# EAGLE design 6 Channel SSR (EAGLE 5.09)
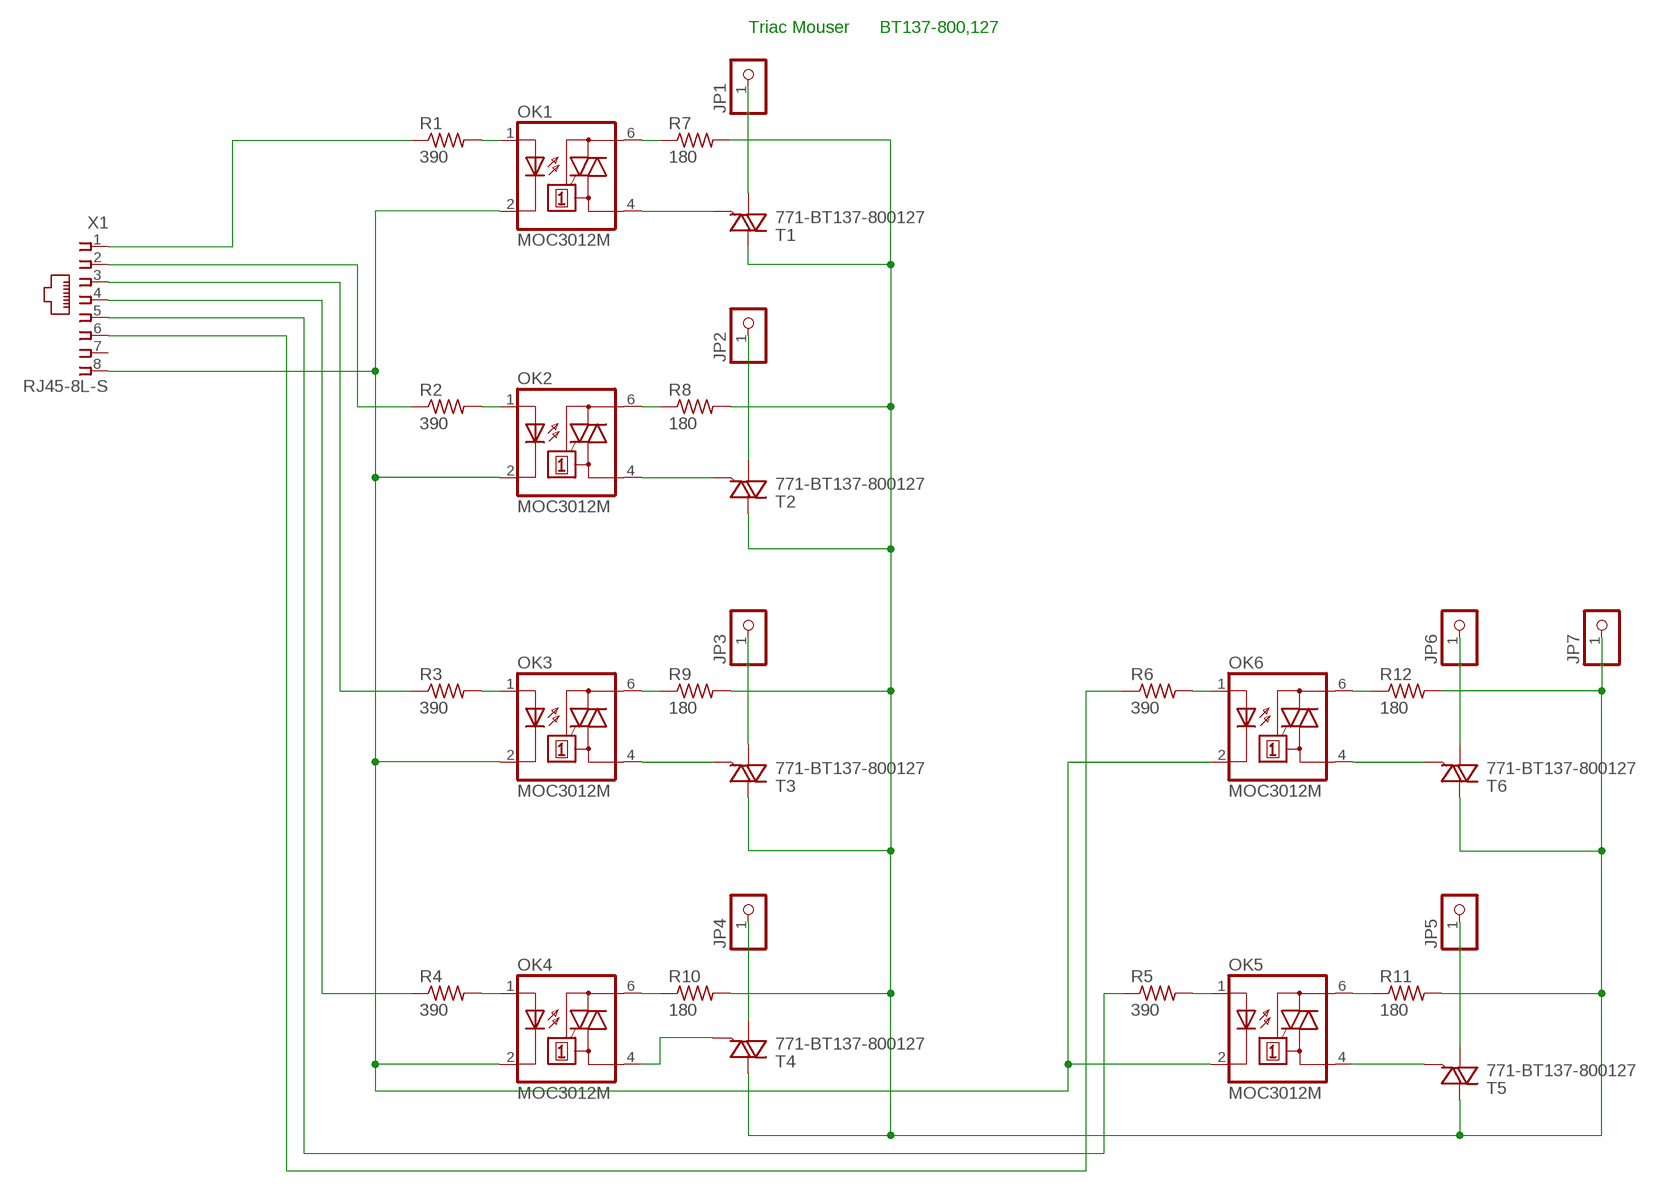
[diagram p0: schematic, sheet 1]

## Parts
JP1  PINHD-1X1  [1X01]
JP2  PINHD-1X1  [1X01]
JP3  PINHD-1X1  [1X01]
JP4  PINHD-1X1  [1X01]
JP5  PINHD-1X1  [1X01]
JP6  PINHD-1X1  [1X01]
JP7  PINHD-1X1  [1X01]
OK1  MOC3012M  MOC3010M  [DIL06]
OK2  MOC3012M  MOC3010M  [DIL06]
OK3  MOC3012M  MOC3010M  [DIL06]
OK4  MOC3012M  MOC3010M  [DIL06]
OK5  MOC3012M  MOC3010M  [DIL06]
OK6  MOC3012M  MOC3010M  [DIL06]
R1  390  R-US_0207/10  [0207/10]
R2  390  R-US_0207/10  [0207/10]
R3  390  R-US_0207/10  [0207/10]
R4  390  R-US_0207/10  [0207/10]
R5  390  R-US_0207/10  [0207/10]
R6  390  R-US_0207/10  [0207/10]
R7  180  R-US_0207/10  [0207/10]
R8  180  R-US_0207/10  [0207/10]
R9  180  R-US_0207/10  [0207/10]
R10  180  R-US_0207/10  [0207/10]
R11  180  R-US_0207/10  [0207/10]
R12  180  R-US_0207/10  [0207/10]
T1  771-BT137-800127  TIC206D  [TO220BV]
T2  771-BT137-800127  TIC206D  [TO220BV]
T3  771-BT137-800127  TIC206D  [TO220BV]
T4  771-BT137-800127  TIC206D  [TO220BV]
T5  771-BT137-800127  TIC206D  [TO220BV]
T6  771-BT137-800127  TIC206D  [TO220BV]
X1  RJ45-8L-S  [RJ45-NO-SHIELD]

## Nets
N$1: OK1.4(A1) T1.G
N$2: OK1.6(A2) R7.1
N$3: OK1.1(A) R1.2
N$4: OK2.1(A) R2.2
N$5: R1.1 X1.1
N$6: JP7.1 R7.2 R8.2 R9.2 R10.2 R11.2 R12.2 T1.T2(A2) T2.T2(A2) T3.T2(A2) T4.T2(A2) T5.T2(A2) T6.T2(A2)
N$7: OK2.4(A1) T2.G
N$8: OK2.6(A2) R8.1
N$9: JP2.1 T2.T1(A1)
N$10: OK3.1(A) R3.2
N$11: OK3.6(A2) R9.1
N$12: OK3.4(A1) T3.G
N$13: JP3.1 T3.T1(A1)
N$14: OK4.4(A1) T4.G
N$15: OK4.6(A2) R10.1
N$16: OK4.1(A) R4.2
N$17: JP4.1 T4.T1(A1)
N$18: R2.1 X1.2
N$19: OK5.1(A) R5.2
N$20: OK5.4(A1) T5.G
N$21: OK5.6(A2) R11.1
N$22: JP5.1 T5.T1(A1)
N$23: OK6.1(A) R6.2
N$24: OK6.6(A2) R12.1
N$25: OK6.4(A1) T6.G
N$26: JP6.1 T6.T1(A1)
N$27: R3.1 X1.3
N$28: OK1.2(C) OK2.2(C) OK3.2(C) OK4.2(C) OK5.2(C) OK6.2(C) X1.8
N$32: JP1.1 T1.T1(A1)
N$33: R4.1 X1.4
N$39: R5.1 X1.5
N$40: R6.1 X1.6
Unconnected: X1.7

## Notes on the sheet
- Triac Mouser      BT137-800,127

## Library data of the parts
JP1-JP7 = pinhead:PINHD-1X1: PIN HEADER
OK1-OK6 = optocoupler:MOC30*M: RANDOM-PHASE OPTOISOLATORS TRIAC DRIVER OUTPUT Source: http://www.fairchildsemi.com MOC3020-M.pdf
R1-R12 = rcl:R-US_: RESISTOR, American symbol
T1-T6 = triac:TIC206: TRIAC Source: http://www.bourns.com/pdfs/tic206.pdf
X1 = con-tycoelectronics:RJ45: CORCOM Modular RJ Jacks No Shield Source: www.tycoelectronics.com .. ENG_DS_1654001_1099_RJ_L_0507.pdf

## Board
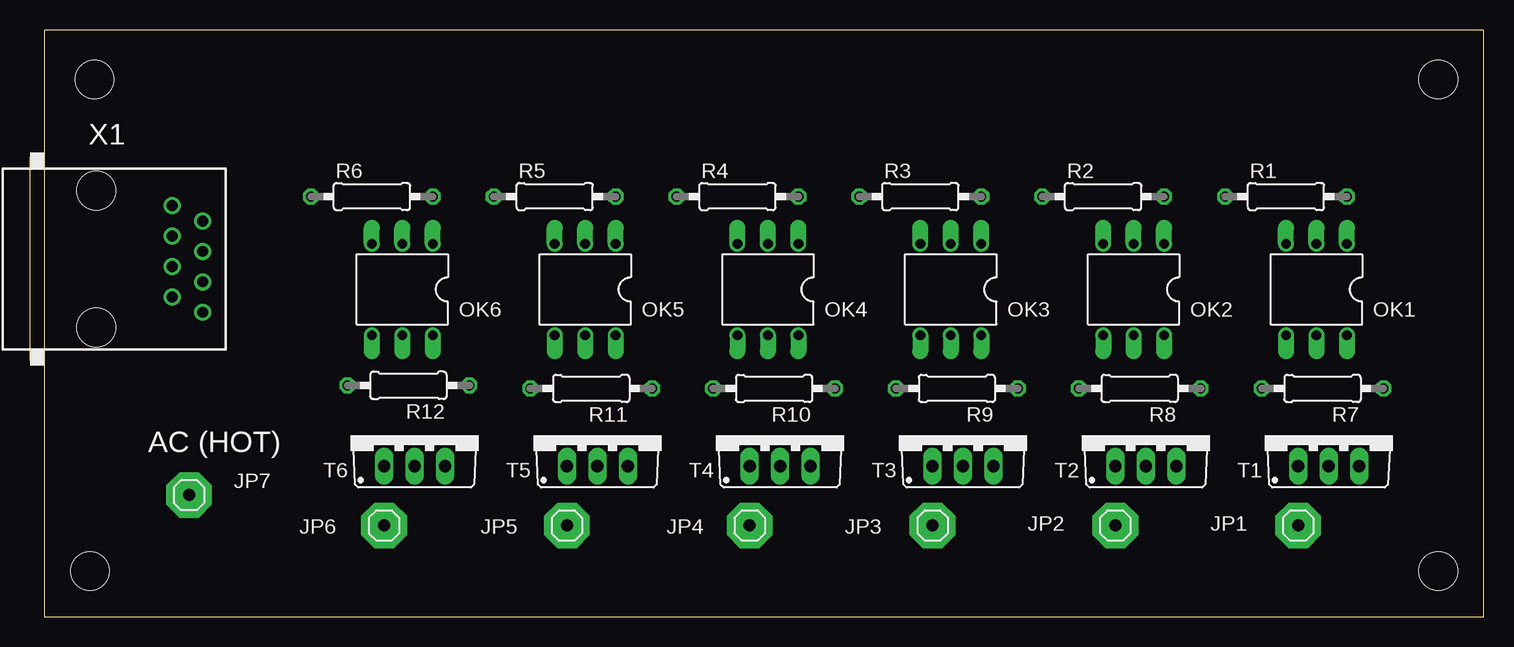
[diagram p1: board, top side]
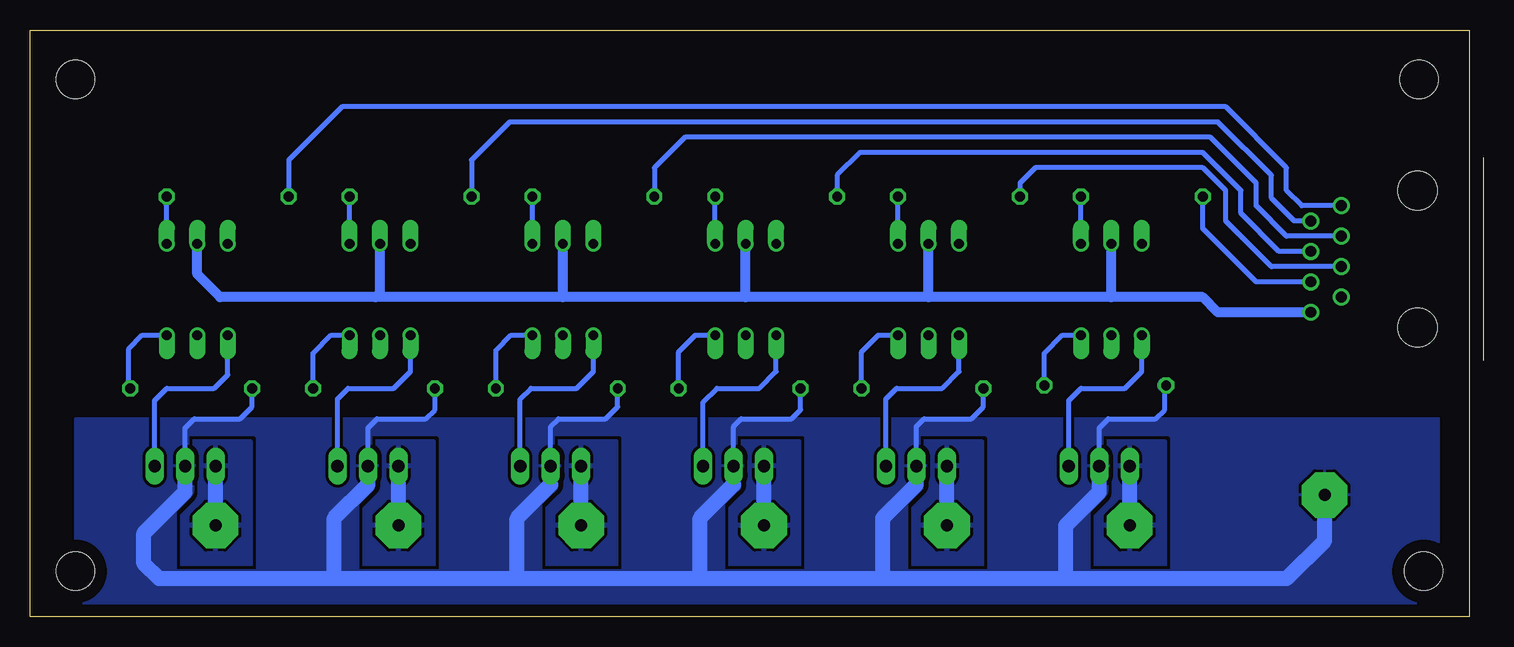
[diagram p2: board, bottom side, seen from below]

Size 119.99 x 48.95 mm. Coordinates in mm from the lower left corner, seen from the top.
Outline: 0,0 119.99,0 119.99,48.95 0,48.95 0,0
Copper layers (1*16): Top 0.035mm / dielectric 1.5mm / Bottom 0.035mm
Design rules "default": minimum track width 10mil, minimum drill 24mil, track to track 8mil, track to pad 8mil, pad to pad 8mil, via to via 8mil, smd to smd 8mil, copper to edge 40mil, drill to drill 8mil, minimum pad ring 10mil, minimum via ring 8mil, stop-mask expansion 4mil, vias tented up to drill 0mil, thermal gap 10mil
Holes 3.2 mm at 4.19,44.83 3.81,3.81 116.2,3.81 116.2,44.83

### Footprints (pad centres in the part's own frame; a part is rotated, then mirrored left to right if it is on the bottom)
1X01 = drill 1 pad 3.81 octagon: 1 0,0
DIL06 = drill 0.813 offset: 1 -2.54,-3.81; 2 0,-3.81; 3 2.54,-3.81; 4 2.54,3.81; 5 0,3.81; 6 -2.54,3.81
0207/10 = drill 0.813 octagon: 1 -5.08,0; 2 5.08,0
TO220BV = drill 1.016 long: G 2.54,-2.54; T1 -2.54,-2.54; T2 0,-2.54
RJ45-NO-SHIELD = drill 0.9 pad 1.4 round: 1 -4.445,6.35; 2 -3.175,8.89; 3 -1.905,6.35; 4 -0.635,8.89; 5 0.635,6.35; 6 1.905,8.89; 7 3.175,6.35; 8 4.445,8.89 | hole 3.251: -5.715,0; 5.715,0

### Placement (x,y rotation side)
JP1  104.52,7.62 0 top
JP2  89.28,7.62 0 top
JP3  74.04,7.62 0 top
JP4  58.8,7.62 0 top
JP5  43.56,7.62 0 top
JP6  28.32,7.62 0 top
JP7  12.06,10.16 0 top
OK1  106.05,27.3 180 top
OK2  90.81,27.3 180 top
OK3  75.56,27.3 180 top
OK4  60.33,27.3 180 top
OK5  45.09,27.3 180 top
OK6  29.84,27.3 180 top
R1  103.5,35.05 0 top
R2  88.27,35.05 0 top
R3  73.03,35.05 0 top
R4  57.78,35.05 0 top
R5  42.55,35.05 0 top
R6  27.3,35.05 0 top
R7  106.55,19.05 180 top
R8  91.31,19.05 180 top
R9  76.07,19.05 180 top
R10  60.83,19.05 180 top
R11  45.59,19.05 180 top
R12  30.35,19.3 180 top
T1  107.06,15.11 0 top
T2  91.82,15.11 0 top
T3  76.58,15.11 0 top
T4  61.34,15.11 0 top
T5  46.1,15.11 0 top
T6  30.86,15.11 0 top
X1  4.32,29.84 270 top

### Tracks (layer width: path | path; a pad name or v marks a point on that pad's centre or on a via)
N$1
  Bottom 0.406: OK1.4 103.5,20.19 104.65,19.05 108.58,19.05 109.6,18.03 T1.G
N$2
  Bottom 0.406: OK1.6 110.62,23.5 111.76,22.35 111.76,19.18 R7.1
N$3
  Bottom 0.406: OK1.1 R1.2
N$4
  Bottom 0.406: OK2.1 R2.2
N$5
  Bottom 0.406: X1.1 13.97,34.29 15.24,35.56 15.24,37.47 20.32,42.55 93.98,42.55 98.42,38.1 R1.1
N$6
  Bottom 0.406: 25.4,19.3 25.4,17.27 26.16,16.51 30.1,16.51 30.86,15.75 T6.T2 | R11.2 40.51,17.53 41.53,16.51 45.47,16.51 46.1,15.88 T5.T2 | R10.2 55.75,17.27 56.52,16.51 60.71,16.51 61.34,15.88 T4.T2 | R9.2 70.99,17.53 72.01,16.51 75.95,16.51 76.58,15.88 T3.T2 | R8.2 86.23,17.27 87,16.51 91.06,16.51 91.82,15.75 T2.T2 | R7.2 101.47,17.53 102.49,16.51 106.3,16.51 107.06,15.75 T1.T2
  Bottom 1.27: 25.4,19.3 R12.2 | T6.T2 30.86,10.41 33.66,7.62 33.66,3.17 | T5.T2 46.1,11.05 48.9,8.26 48.9,3.17 | T4.T2 61.34,11.05 64.14,8.26 64.14,3.17 | T2.T2 91.82,11.05 94.61,8.26 94.61,3.17 | T3.T2 76.58,11.05 79.38,8.26 79.38,3.17 | JP7.1 12.06,6.35 15.24,3.17 109.22,3.17 110.49,4.45 110.49,6.99 107.06,10.41 T1.T2
  pour Bottom (isolate 0.254, rank 2): 2.54,16.51 116.2,16.51 116.2,0.64 2.54,0.64
N$7
  Bottom 0.406: OK2.4 88.27,20.45 89.66,19.05 93.47,19.05 94.36,18.16 T2.G
N$8
  Bottom 0.406: OK2.6 94.87,23.5 96.39,21.97 R8.1
N$9
  Bottom 1.27: JP2.1 T2.T1
  pour Bottom (isolate 0.406): 87,14.61 92.08,14.61 92.08,13.97 92.08,3.81 86.36,3.81 86.36,4.45 86.36,14.61
N$10
  Bottom 0.406: OK3.1 R3.2
N$11
  Bottom 0.406: OK3.6 79.88,23.5 81.15,22.23 R9.1
N$12
  Bottom 0.406: OK3.4 73.03,20.45 74.42,19.05 78.23,19.05 79.12,18.16 T3.G
N$13
  Bottom 1.27: JP3.1 T3.T1
  pour Bottom (isolate 0.406): 71.75,14.61 76.83,14.61 76.83,13.97 76.83,3.81 71.12,3.81 71.12,4.45 71.12,14.61
N$14
  Bottom 0.406: OK4.4 57.78,20.45 59.18,19.05 62.74,19.05 63.88,17.91 T4.G
N$15
  Bottom 0.406: OK4.6 64.52,23.5 65.91,22.1 R10.1
N$16
  Bottom 0.406: OK4.1 R4.2
N$17
  Bottom 1.27: JP4.1 T4.T1
  pour Bottom (isolate 0.406): 56.52,14.61 61.59,14.61 61.59,13.97 61.59,3.81 55.88,3.81 55.88,4.45 55.88,14.61
N$18
  Bottom 0.406: X1.2 14.61,33.02 16.51,34.92 16.51,36.83 20.95,41.27 80.01,41.27 83.19,38.1 R2.1
N$19
  Bottom 0.406: OK5.1 R5.2
N$20
  Bottom 0.406: OK5.4 42.55,20.45 43.94,19.05 47.75,19.05 48.64,18.16 T5.G
N$21
  Bottom 0.406: OK5.6 49.28,23.5 50.67,22.1 R11.1
N$22
  Bottom 1.27: JP5.1 T5.T1
  pour Bottom (isolate 0.406): 41.27,14.61 46.35,14.61 46.35,13.97 46.35,3.81 40.64,3.81 40.64,4.45 40.64,14.61
N$23
  Bottom 0.406: OK6.1 R6.2
N$24
  Bottom 0.406: OK6.6 33.91,23.5 35.43,21.97 R12.1
N$25
  Bottom 0.406: OK6.4 27.3,20.45 28.7,19.05 32.38,19.05 33.4,18.03 T6.G
N$26
  Bottom 1.27: JP6.1 T6.T1
  pour Bottom (isolate 0.406): 26.04,14.61 31.11,14.61 31.11,13.97 31.11,3.81 25.4,3.81 25.4,4.45 25.4,14.61
N$27
  Bottom 0.406: X1.3 15.24,31.75 17.78,34.29 17.78,36.2 21.59,40.01 65.41,40.01 67.94,37.47 R3.1
N$28
  Bottom 0.813: 29.84,26.67 45.09,26.67 | 45.09,26.67 60.33,26.67 | 60.33,26.67 75.56,26.67 | 75.56,26.67 91.19,26.67 | 91.19,26.67 104.14,26.67 106.05,28.57 OK1.2 | 29.84,26.67 OK6.2 | 75.56,26.67 OK3.2 | 60.33,26.67 OK4.2 | 45.09,26.67 OK5.2 | OK2.2 90.81,27.05 91.19,26.67 | 29.84,26.67 22.23,26.67 20.95,25.4 X1.8
N$32
  Bottom 1.27: JP1.1 T1.T1
  pour Bottom (isolate 0.406): 102.23,14.61 107.31,14.61 107.31,13.97 107.31,3.81 101.6,3.81 101.6,4.45 101.6,14.61
N$33
  Bottom 0.406: X1.4 15.88,30.48 19.05,33.66 19.05,35.56 22.23,38.73 50.8,38.73 52.7,36.83 R4.1
N$39
  Bottom 0.406: X1.5 16.51,29.21 20.32,33.02 20.32,35.56 22.23,37.47 36.2,37.47 37.47,36.2 R5.1
N$40
  Bottom 0.406: X1.6 17.78,27.94 22.23,32.38 R6.1

### Text on the board
tPlace: AC (HOT)